# Altium schematic sheet 1-RevisionHistory.SchDoc
size 431 x 279 mm; Organization: ORGANIZATION; Address1: ADDRESS 1; Address2: ADDRESS 2; Address3: ADDRESS 3; Address4: ADDRESS 4; DocumentNumber: 1; Revision: -; SheetNumber: 1; SheetTotal: 14; ENG_APP_DATE: --/--/--; DSN_APP_DATE: --/--/--; CHK_APP_DATE: --/--/--
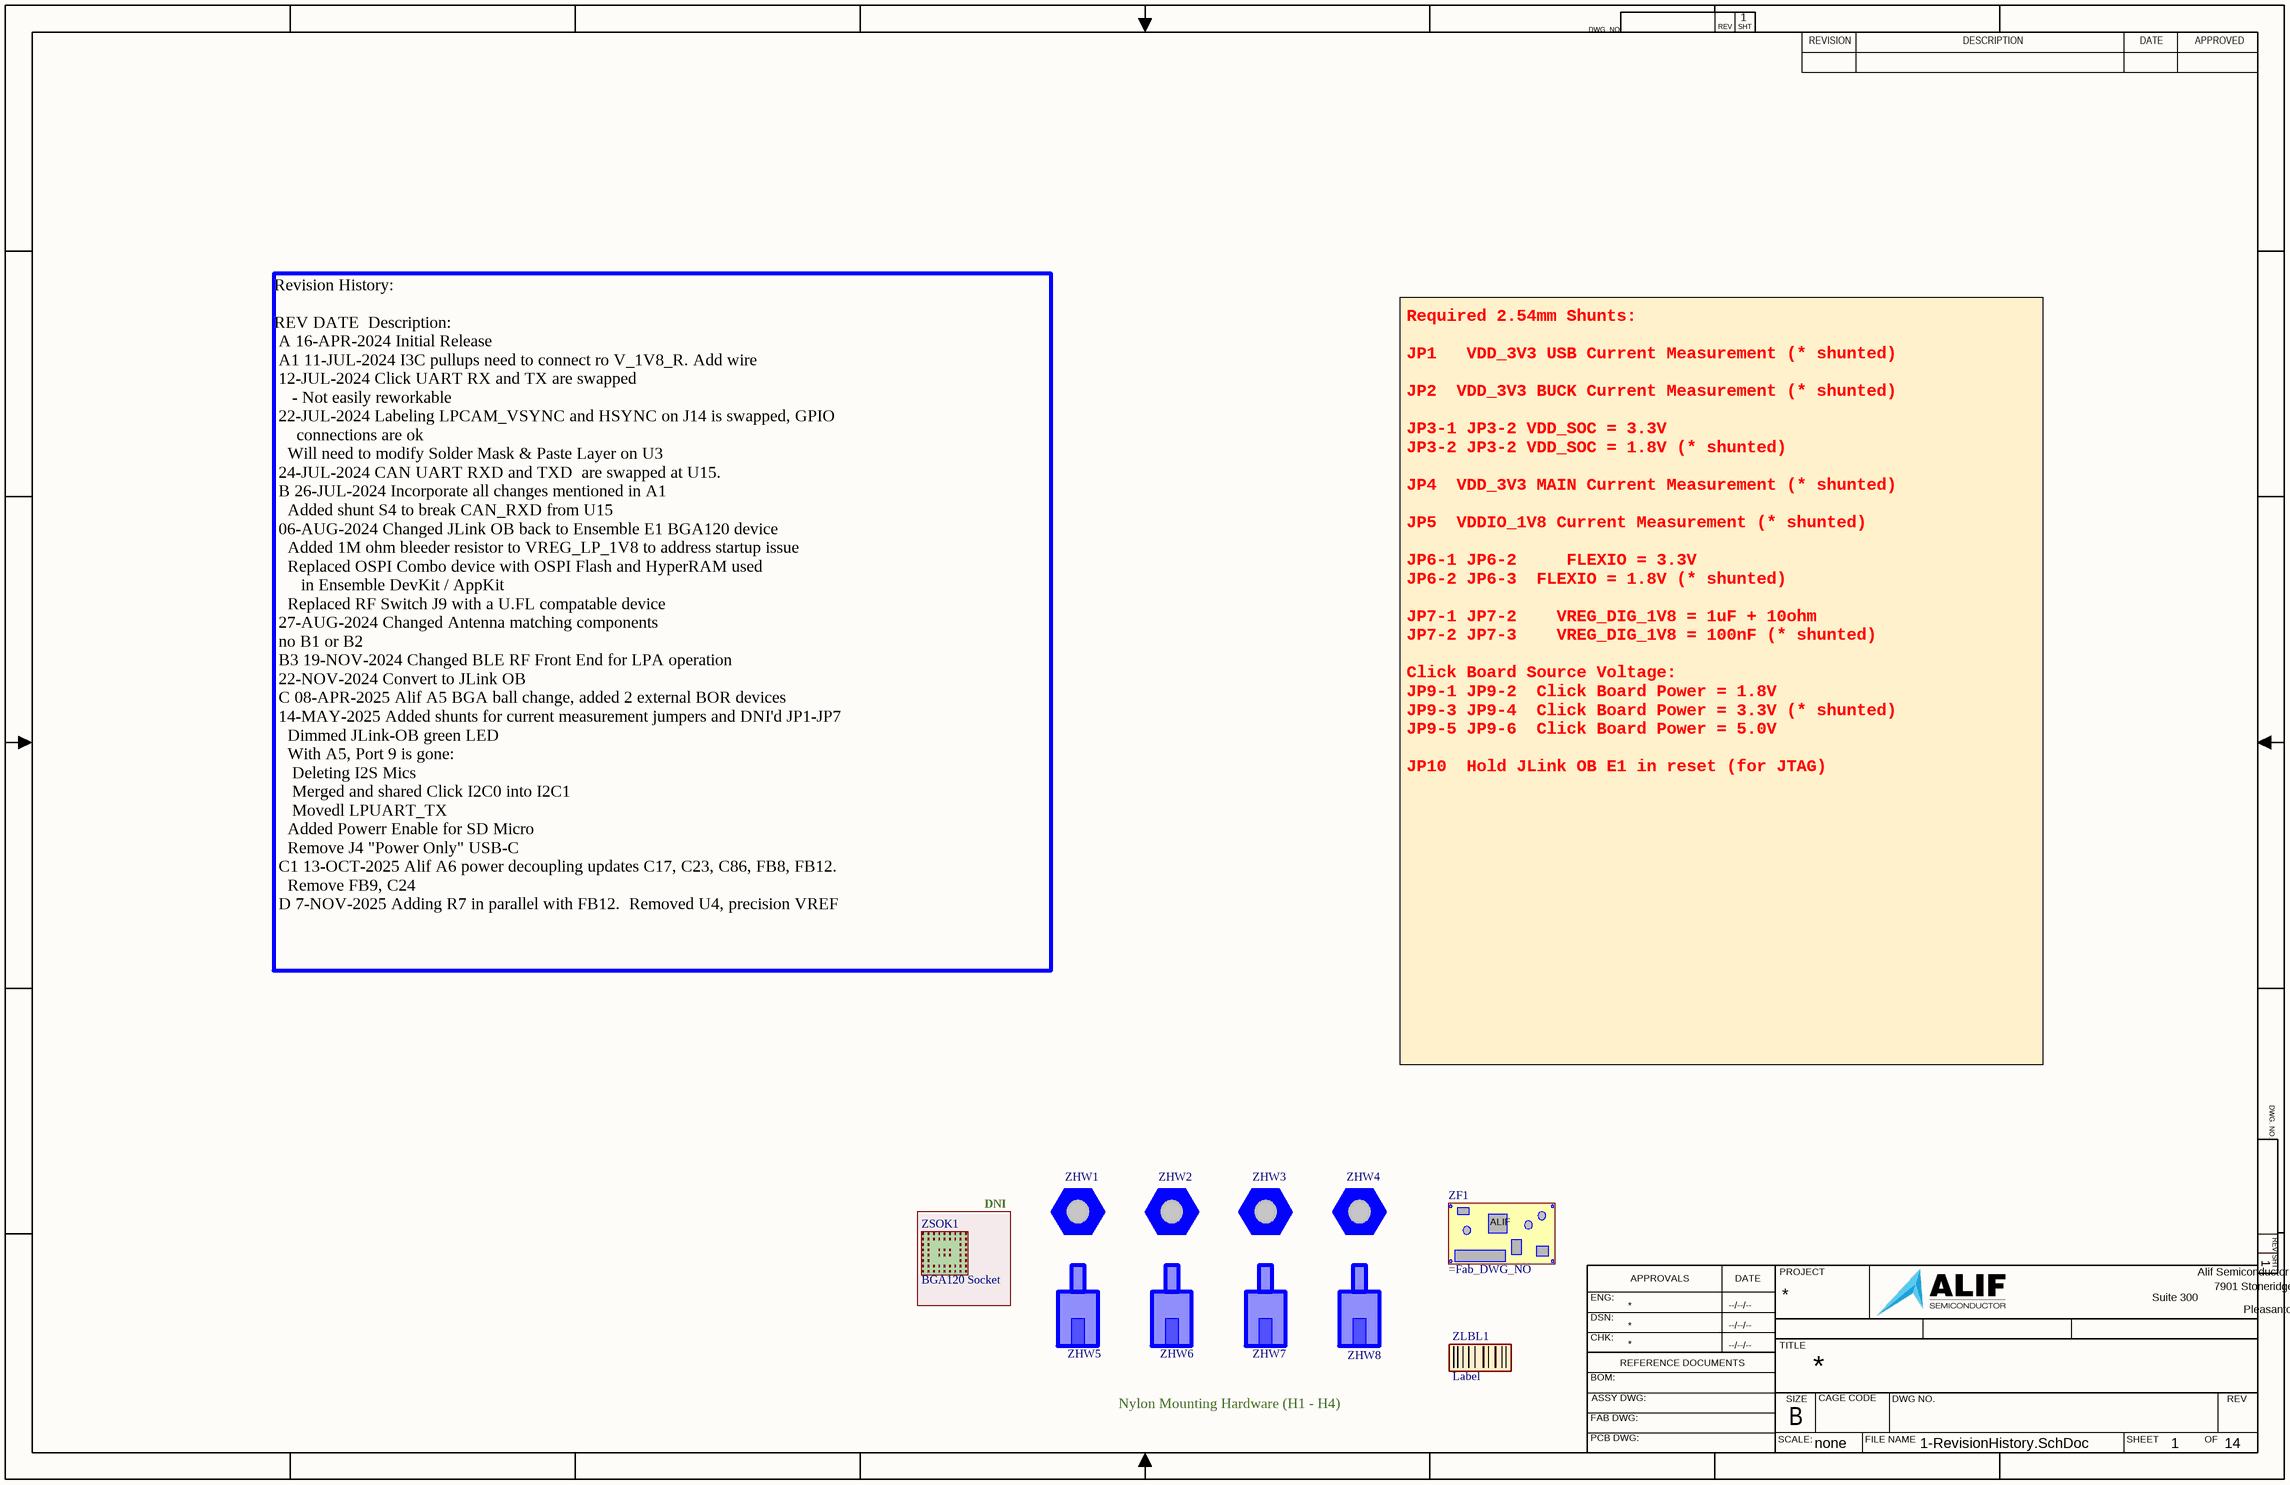
[diagram p0: 1-RevisionHistory.SchDoc]

## Parts
ZF1  (no value)  (mechanical)
ZHW1  #4-40  (value not drawn)  (mechanical)
ZHW2  #4-40  (value not drawn)  (mechanical)
ZHW3  #4-40  (value not drawn)  (mechanical)
ZHW4  #4-40  (value not drawn)  (mechanical)
ZHW5  #4-40 1/4"  (value not drawn)  (mechanical)
ZHW6  #4-40 1/4"  (value not drawn)  (mechanical)
ZHW7  #4-40 1/4"  (value not drawn)  (mechanical)
ZHW8  #4-40 1/4"  (value not drawn)  (mechanical)
ZLBL1  Label  (mechanical)
ZSOK1  BGA120 Socket  (mechanical)

## Blocks framed on the sheet
DNI: ZSOK1

## Notes on the sheet
- Revision History:
  REV	DATE		Description:
  A	16-APR-2024	Initial Release
  A1	11-JUL-2024	I3C pullups need to connect ro V_1V8_R. Add wire
  12-JUL-2024	Click UART RX and TX are swapped
  - Not easily reworkable
  22-JUL-2024	Labeling LPCAM_VSYNC and HSYNC on J14 is swapped, GPIO
  connections are ok
  Will need to modify Solder Mask & Paste Layer on U3
  24-JUL-2024	CAN UART RXD and TXD  are swapped at U15.
  B	26-JUL-2024	Incorporate all changes mentioned in A1
  Added shunt S4 to break CAN_RXD from U15
  06-AUG-2024	Changed JLink OB back to Ensemble E1 BGA120 device
  Added 1M ohm bleeder resistor to VREG_LP_1V8 to address startup issue
  Replaced OSPI Combo device with OSPI Flash and HyperRAM used
  in Ensemble DevKit / AppKit
  Replaced RF Switch J9 with a U.FL compatable device
  27-AUG-2024	Changed Antenna matching components
  no B1 or B2
  B3	19-NOV-2024	Changed BLE RF Front End for LPA operation
  22-NOV-2024	Convert to JLink OB
  C	08-APR-2025	Alif A5 BGA ball change, added 2 external BOR devices
  14-MAY-2025	Added shunts for current measurement jumpers and DNI'd JP1-JP7
  Dimmed JLink-OB green LED
  With A5, Port 9 is gone:
  Deleting I2S Mics
  Merged and shared Click I2C0 into I2C1
  Movedl LPUART_TX
  Added Powerr Enable for SD Micro
  Remove J4 "Power Only" USB-C
  C1	13-OCT-2025	Alif A6 power decoupling updates C17, C23, C86, FB8, FB12.
  Remove FB9, C24
  D	7-NOV-2025	Adding R7 in parallel with FB12.  Removed U4, precision VREF
- Required 2.54mm Shunts:
  JP1 		VDD_3V3 USB Current Measurement (* shunted)
  JP2		VDD_3V3 BUCK Current Measurement (* shunted)
  JP3-1 JP3-2	VDD_SOC = 3.3V
  JP3-2 JP3-2	VDD_SOC = 1.8V (* shunted)
  JP4		VDD_3V3 MAIN Current Measurement (* shunted)
  JP5		VDDIO_1V8 Current Measurement (* shunted)
  JP6-1 JP6-2     FLEXIO = 3.3V
  JP6-2 JP6-3 	FLEXIO = 1.8V (* shunted)
  JP7-1 JP7-2   	VREG_DIG_1V8 = 1uF + 10ohm
  JP7-2 JP7-3   	VREG_DIG_1V8 = 100nF (* shunted)
  Click Board Source Voltage:
  JP9-1 JP9-2 	Click Board Power = 1.8V
  JP9-3 JP9-4 	Click Board Power = 3.3V (* shunted)
  JP9-5 JP9-6 	Click Board Power = 5.0V
  JP10		Hold JLink OB E1 in reset (for JTAG)
- Nylon Mounting Hardware (H1 - H4)
- DWG. NO.
- REV
- SHT
- REVISION
- DESCRIPTION
- DATE
- APPROVED
- ENG:
- APPROVALS
- PROJECT
- Suite 300
- Alif Semiconductor
- 7901 Stoneridge Drive
- DSN:
- CHK:
- REFERENCE DOCUMENTS
- TITLE
- Pleasanton, CA 94588  USA
- BOM:
- FAB DWG:
- PCB DWG:
- ASSY DWG:
- SCALE:
- SIZE
- B
- CAGE CODE
- FILE NAME
- DWG NO.
- SHEET
- OF
- none
- (in symbol PCB_FAB) ALIF

## Library data of the parts
ZF1 = PCB_FAB: Printed Circuit Board  Fabrication; Manufacturer 1: Alif Semi; Manufacturer Part Number 1: =PCB_DWG_NO; Manufacturer 2: *; Manufacturer Part Number 2: *; Manufacturer 3: *; Manufacturer Part Number 3: *
ZHW1-ZHW4 = HW_NUT: Hardware, Nut, Hex, #4-40 x 1/8" H, 1/4" Dia, Nylon; Manufacturer 1: Essentra Comp; Manufacturer Part Number 1: 0400440HNS; Manufacturer 2: *; Manufacturer Part Number 2: *; Manufacturer 3: *; Manufacturer Part Number 3: *
ZHW5-ZHW8 = HW_STANDOFF_MF: Hardware, Standoff, Hex Male-Female, #4-40 x 1/4" H, 1/4" Dia, Nylon; Manufacturer 1: Keystone; Manufacturer Part Number 1: 4800; Manufacturer 2: Essentra Comp; Manufacturer Part Number 2: 36440MF025; Manufacturer 3: RAF Elec; Manufacturer Part Number 3: 4530-440-N
ZLBL1 = MOD_LABEL_GENERIC: Label, UPC, Agency and Lot Num, Low Cost Balletto DevKit; Manufacturer 1: Alif; Manufacturer Part Number 1: -need a p/n-; Manufacturer 2: *; Manufacturer Part Number 2: *; Manufacturer 3: *; Manufacturer Part Number 3: *
ZSOK1 = MOD_SOCKET: DNI, Socket, IC Test, BGA120; Manufacturer 1: TwinSocket; Manufacturer Part Number 1: TIUI2050-00120-01; Manufacturer 2: *; Manufacturer Part Number 2: *; Manufacturer 3: *; Manufacturer Part Number 3: *